# Altium schematic sheet motor_drive.SchDoc
size A2
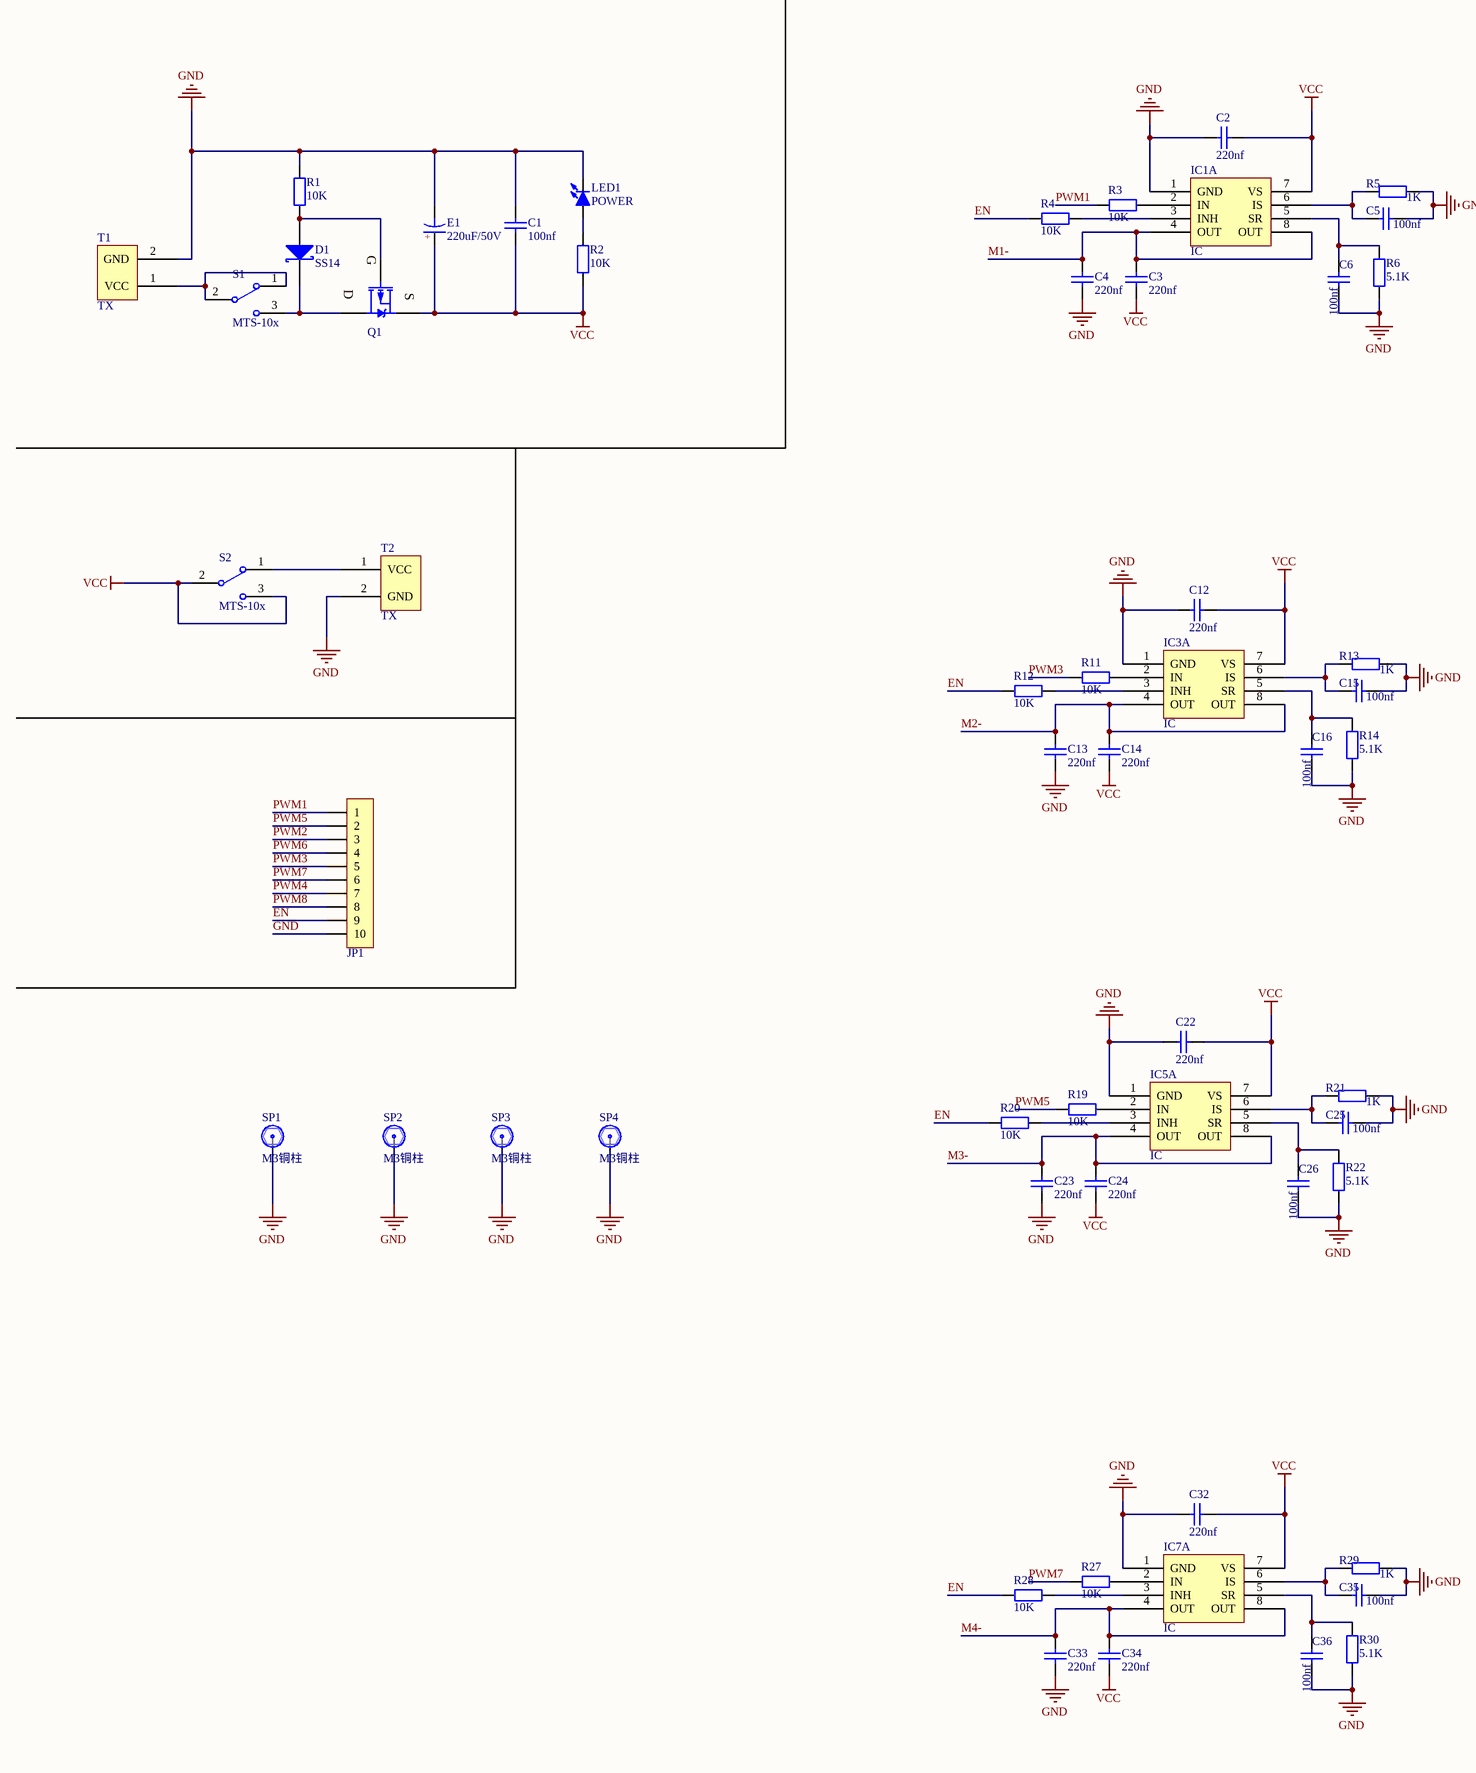
[diagram p0: motor_drive.SchDoc, left]
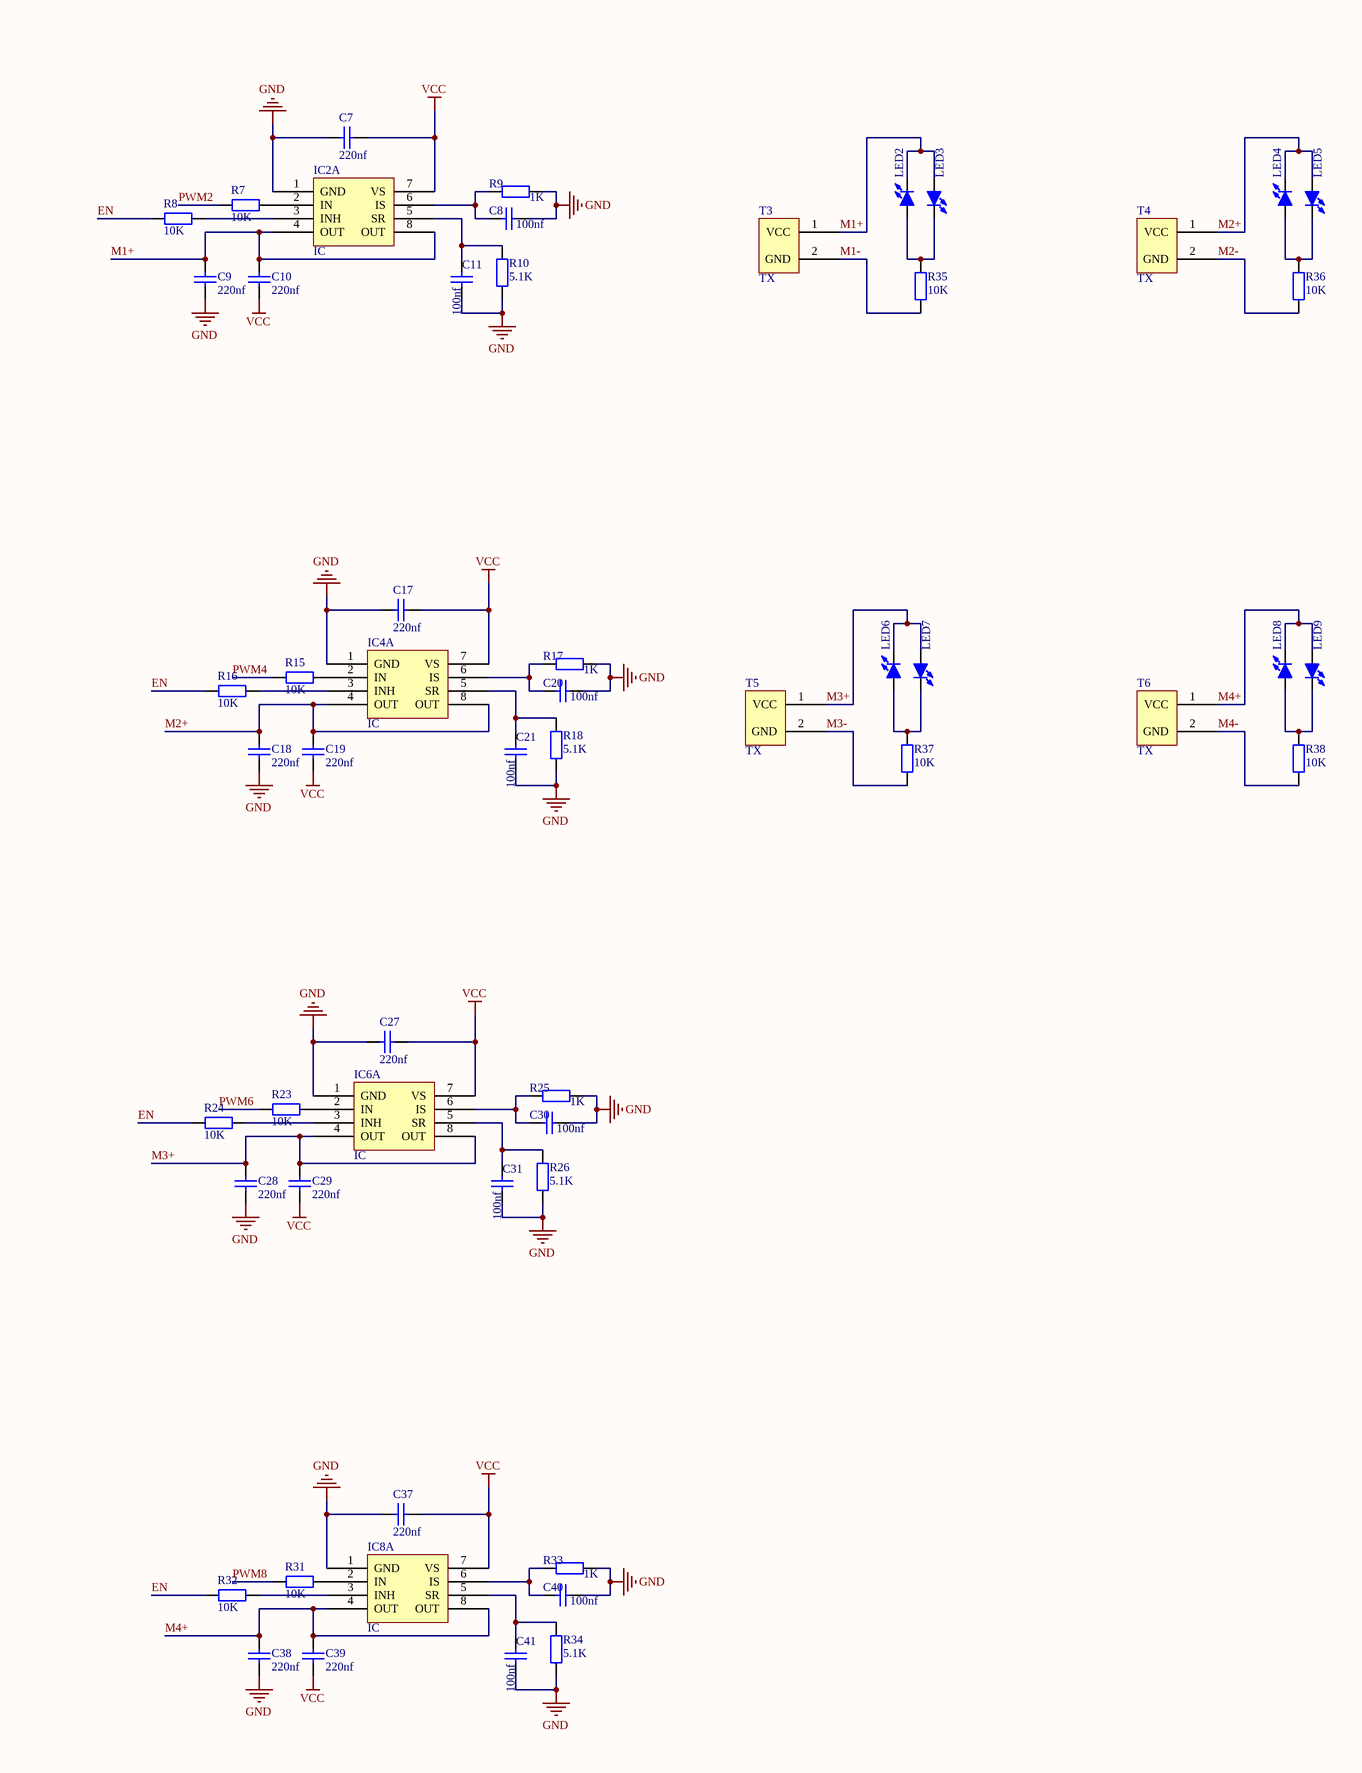
[diagram p1: motor_drive.SchDoc, right]

## Parts
C1  100nf  [C0805_L]
C2  220nf  [C0805_L]
C3  220nf  [C0805_L]
C4  220nf  [C0805_L]
C5  100nf  [C0805_L]
C6  100nf  [C0805_L]
C7  220nf  [C0805_L]
C8  100nf  [C0805_L]
C9  220nf  [C0805_L]
C10  220nf  [C0805_L]
C11  100nf  [C0805_L]
C12  220nf  [C0805_L]
C13  220nf  [C0805_L]
C14  220nf  [C0805_L]
C15  100nf  [C0805_L]
C16  100nf  [C0805_L]
C17  220nf  [C0805_L]
C18  220nf  [C0805_L]
C19  220nf  [C0805_L]
C20  100nf  [C0805_L]
C21  100nf  [C0805_L]
C22  220nf  [C0805_L]
C23  220nf  [C0805_L]
C24  220nf  [C0805_L]
C25  100nf  [C0805_L]
C26  100nf  [C0805_L]
C27  220nf  [C0805_L]
C28  220nf  [C0805_L]
C29  220nf  [C0805_L]
C30  100nf  [C0805_L]
C31  100nf  [C0805_L]
C32  220nf  [C0805_L]
C33  220nf  [C0805_L]
C34  220nf  [C0805_L]
C35  100nf  [C0805_L]
C36  100nf  [C0805_L]
C37  220nf  [C0805_L]
C38  220nf  [C0805_L]
C39  220nf  [C0805_L]
C40  100nf  [C0805_L]
C41  100nf  [C0805_L]
D1  SS14  [SMA]
E1  220uF/50V  [CE F(10*10.2)]
IC1  IC  (part A of 2)
IC2  IC  (part A of 2)
IC3  IC  (part A of 2)
IC4  IC  (part A of 2)
IC5  IC  (part A of 2)
IC6  IC  (part A of 2)
IC7  IC  (part A of 2)
IC8  IC  (part A of 2)
JP1  HDR-1X10  [XH2.54-LI-10P]  (value not drawn)
LED1  POWER  [LED 0805R]
LED2  (no value)  [LED 0805R]
LED3  (no value)  [LED 0805R]
LED4  (no value)  [LED 0805R]
LED5  (no value)  [LED 0805R]
LED6  (no value)  [LED 0805R]
LED7  (no value)  [LED 0805R]
LED8  (no value)  [LED 0805R]
LED9  (no value)  [LED 0805R]
Q1  D15P05  [TO252]  (value not drawn)
R1  10K  [R0805_L]
R2  10K  [R0805_L]
R3  10K  [R0805_L]
R4  10K  [R0805_L]
R5  1K  [R0805_L]
R6  5.1K  [R0805_L]
R7  10K  [R0805_L]
R8  10K  [R0805_L]
R9  1K  [R0805_L]
R10  5.1K  [R0805_L]
R11  10K  [R0805_L]
R12  10K  [R0805_L]
R13  1K  [R0805_L]
R14  5.1K  [R0805_L]
R15  10K  [R0805_L]
R16  10K  [R0805_L]
R17  1K  [R0805_L]
R18  5.1K  [R0805_L]
R19  10K  [R0805_L]
R20  10K  [R0805_L]
R21  1K  [R0805_L]
R22  5.1K  [R0805_L]
R23  10K  [R0805_L]
R24  10K  [R0805_L]
R25  1K  [R0805_L]
R26  5.1K  [R0805_L]
R27  10K  [R0805_L]
R28  10K  [R0805_L]
R29  1K  [R0805_L]
R30  5.1K  [R0805_L]
R31  10K  [R0805_L]
R32  10K  [R0805_L]
R33  1K  [R0805_L]
R34  5.1K  [R0805_L]
R35  10K  [R0805_L]
R36  10K  [R0805_L]
R37  10K  [R0805_L]
R38  10K  [R0805_L]
S1  MTS-10x  [MTS-10x]
S2  MTS-10x  [MTS-10x]
SP1  M3铜柱  [M3x4+6_N]
SP2  M3铜柱  [M3x4+6_N]
SP3  M3铜柱  [M3x4+6_N]
SP4  M3铜柱  [M3x4+6_N]
T1  TX  [T接头]
T2  TX  [T接头]
T3  TX  [T接头]
T4  TX  [T接头]
T5  TX  [T接头]
T6  TX  [T接头]

## Nets
GND: C1.2 C2.1 C4.2 C5.1 C6.1 C7.1 C8.1 C9.2 C11.1 C12.1 C13.2 C15.1 C16.1 C17.1 C18.2 C20.1 C21.1 C22.1 C23.2 C25.1 C26.1 C27.1 C28.2 C30.1 C31.1 C32.1 C33.2 C35.1 C36.1 C37.1 C38.2 C40.1 C41.1 E1.2 IC1.1(GND) IC2.1(GND) IC3.1(GND) IC4.1(GND) IC5.1(GND) IC6.1(GND) IC7.1(GND) IC8.1(GND) JP1.10 LED1.2(K) R1.2 R5.1 R6.1 R9.1 R10.1 R13.1 R14.1 R17.1 R18.1 R21.1 R22.1 R25.1 R26.1 R29.1 R30.1 R33.1 R34.1 SP1.1 SP2.1 SP3.1 SP4.1 T1.2(GND) T2.2(GND)
VCC: C1.1 C2.2 C3.2 C7.2 C10.2 C12.2 C14.2 C17.2 C19.2 C22.2 C24.2 C27.2 C29.2 C32.2 C34.2 C37.2 C39.2 E1.1 IC1.7(VS) IC2.7(VS) IC3.7(VS) IC4.7(VS) IC5.7(VS) IC6.7(VS) IC7.7(VS) IC8.7(VS) Q1.3(S) R2.1 S2.2 S2.3
EN: JP1.9 R4.1 R8.1 R12.1 R16.1 R20.1 R24.1 R28.1 R32.1
M1+: C9.1 C10.1 IC2.4(OUT) IC2.8(OUT) LED2.2(K) LED3.1(A) T3.1(VCC)
M1-: C3.1 C4.1 IC1.4(OUT) IC1.8(OUT) R35.1 T3.2(GND)
M2+: C18.1 C19.1 IC4.4(OUT) IC4.8(OUT) LED4.2(K) LED5.1(A) T4.1(VCC)
M2-: C13.1 C14.1 IC3.4(OUT) IC3.8(OUT) R36.1 T4.2(GND)
M3+: C28.1 C29.1 IC6.4(OUT) IC6.8(OUT) LED6.2(K) LED7.1(A) T5.1(VCC)
M3-: C23.1 C24.1 IC5.4(OUT) IC5.8(OUT) R37.1 T5.2(GND)
M4+: C38.1 C39.1 IC8.4(OUT) IC8.8(OUT) LED8.2(K) LED9.1(A) T6.1(VCC)
M4-: C33.1 C34.1 IC7.4(OUT) IC7.8(OUT) R38.1 T6.2(GND)
PWM1: JP1.1 R3.1
PWM2: JP1.3 R7.1
PWM3: JP1.5 R11.1
PWM4: JP1.7 R15.1
PWM5: JP1.2 R19.1
PWM6: JP1.4 R23.1
PWM7: JP1.6 R27.1
PWM8: JP1.8 R31.1
NetC5_2: C5.2 IC1.6(IS) R5.2
NetC6_2: C6.2 IC1.5(SR) R6.2
NetC8_2: C8.2 IC2.6(IS) R9.2
NetC11_2: C11.2 IC2.5(SR) R10.2
NetC15_2: C15.2 IC3.6(IS) R13.2
NetC16_2: C16.2 IC3.5(SR) R14.2
NetC20_2: C20.2 IC4.6(IS) R17.2
NetC21_2: C21.2 IC4.5(SR) R18.2
NetC25_2: C25.2 IC5.6(IS) R21.2
NetC26_2: C26.2 IC5.5(SR) R22.2
NetC30_2: C30.2 IC6.6(IS) R25.2
NetC31_2: C31.2 IC6.5(SR) R26.2
NetC35_2: C35.2 IC7.6(IS) R29.2
NetC36_2: C36.2 IC7.5(SR) R30.2
NetC40_2: C40.2 IC8.6(IS) R33.2
NetC41_2: C41.2 IC8.5(SR) R34.2
NetD1_1: D1.1(A) Q1.1(G) R1.1
NetD1_2: D1.2(K) Q1.2(D) S1.3
NetIC1_2: IC1.2(IN) R3.2
NetIC1_3: IC1.3(INH) R4.2
NetIC2_2: IC2.2(IN) R7.2
NetIC2_3: IC2.3(INH) R8.2
NetIC3_2: IC3.2(IN) R11.2
NetIC3_3: IC3.3(INH) R12.2
NetIC4_2: IC4.2(IN) R15.2
NetIC4_3: IC4.3(INH) R16.2
NetIC5_2: IC5.2(IN) R19.2
NetIC5_3: IC5.3(INH) R20.2
NetIC6_2: IC6.2(IN) R23.2
NetIC6_3: IC6.3(INH) R24.2
NetIC7_2: IC7.2(IN) R27.2
NetIC7_3: IC7.3(INH) R28.2
NetIC8_2: IC8.2(IN) R31.2
NetIC8_3: IC8.3(INH) R32.2
NetLED1_1: LED1.1(A) R2.2
NetLED2_1: LED2.1(A) LED3.2(K) R35.2
NetLED4_1: LED4.1(A) LED5.2(K) R36.2
NetLED6_1: LED6.1(A) LED7.2(K) R37.2
NetLED8_1: LED8.1(A) LED9.2(K) R38.2
NetS1_1: S1.1 S1.2 T1.1(VCC)
NetS2_1: S2.1 T2.1(VCC)

## Notes on the sheet
- Title
- Size:
- Date:
- File:
- A2
- Number:
- Time:
- Revision:
- Sheet
- of
- (in symbol CE_SMD) +

## Library data of the parts
C1-C41 = C: 贴片电容/MLCC电容; BOM名称: 无极性贴片电容; 联系卖家，免费查找封装: 唯一出售店铺网址https://shop463601444.taobao.com
D1 = SS14: 肖特基二极管; 属性: 40V/1A; 以赠品形式获赠本封装库的买家，还可联系卖家免费指导AD软件使用: 封装库来自淘宝卖家ID：黄晶宝石; BOM名称: 肖特基二极管
E1 = CE_SMD: 贴片电解电容; 联系卖家，免费查找封装: 唯一出售店铺网址https://shop463601444.taobao.com; BOM名称: 贴片电解电容
IC1-IC8 = BTN8982
JP1 = Header 10: 10P接插件; 联系卖家，免费查找封装: 唯一出售店铺网址https://shop463601444.taobao.com; 封装库来自淘宝卖家ID:黄晶宝石: 其他店铺购入均为盗版假冒封装库，请立即申请退款，本店现金奖励20~200元; BOM名称: 10P接插件
LED1-LED9 = LED-SMD: 贴片LED; 版权归属: 封装库来自淘宝 ID：黄晶宝石; BOM名称: 贴片LED; 学习资源: https://shop463601444.taobao.com
Q1 = D15P05: P沟道 50V/15A; BOM名称: P沟道场效应管; 以赠品形式获赠 本封装库的买家: 还可以联系卖家远程指导AD软件使用
R1-R38 = R: 贴片电阻; 联系卖家，免费查找封装: 唯一出售店铺网址https://shop463601444.taobao.com; BOM名称: 贴片电阻
S1 S2 = MTS-10x: MTS10x系列3脚扭子开关; 联系卖家，免费查找封装: 唯一出售店铺网址https://shop463601444.taobao.com; 封装库来自淘宝卖家ID：黄晶宝石: 其他店铺购入的，请立即申请退款，本店现金奖励20~500元; BOM名称: MTS10x系列3脚扭子开关
SP1-SP4 = 铜柱加头大焊盘: 铜柱; 联系卖家，免费查找封装: 唯一出售店铺网址https://shop463601444.taobao.com; 封装库来自淘宝卖家ID：黄晶宝石: 其他店铺购入的，请立即申请退款，本店现金奖励20~500元; BOM名称: 铜柱
T1-T6 = T接头